# Altium project KeyBoard-RP2040.PrjPcb
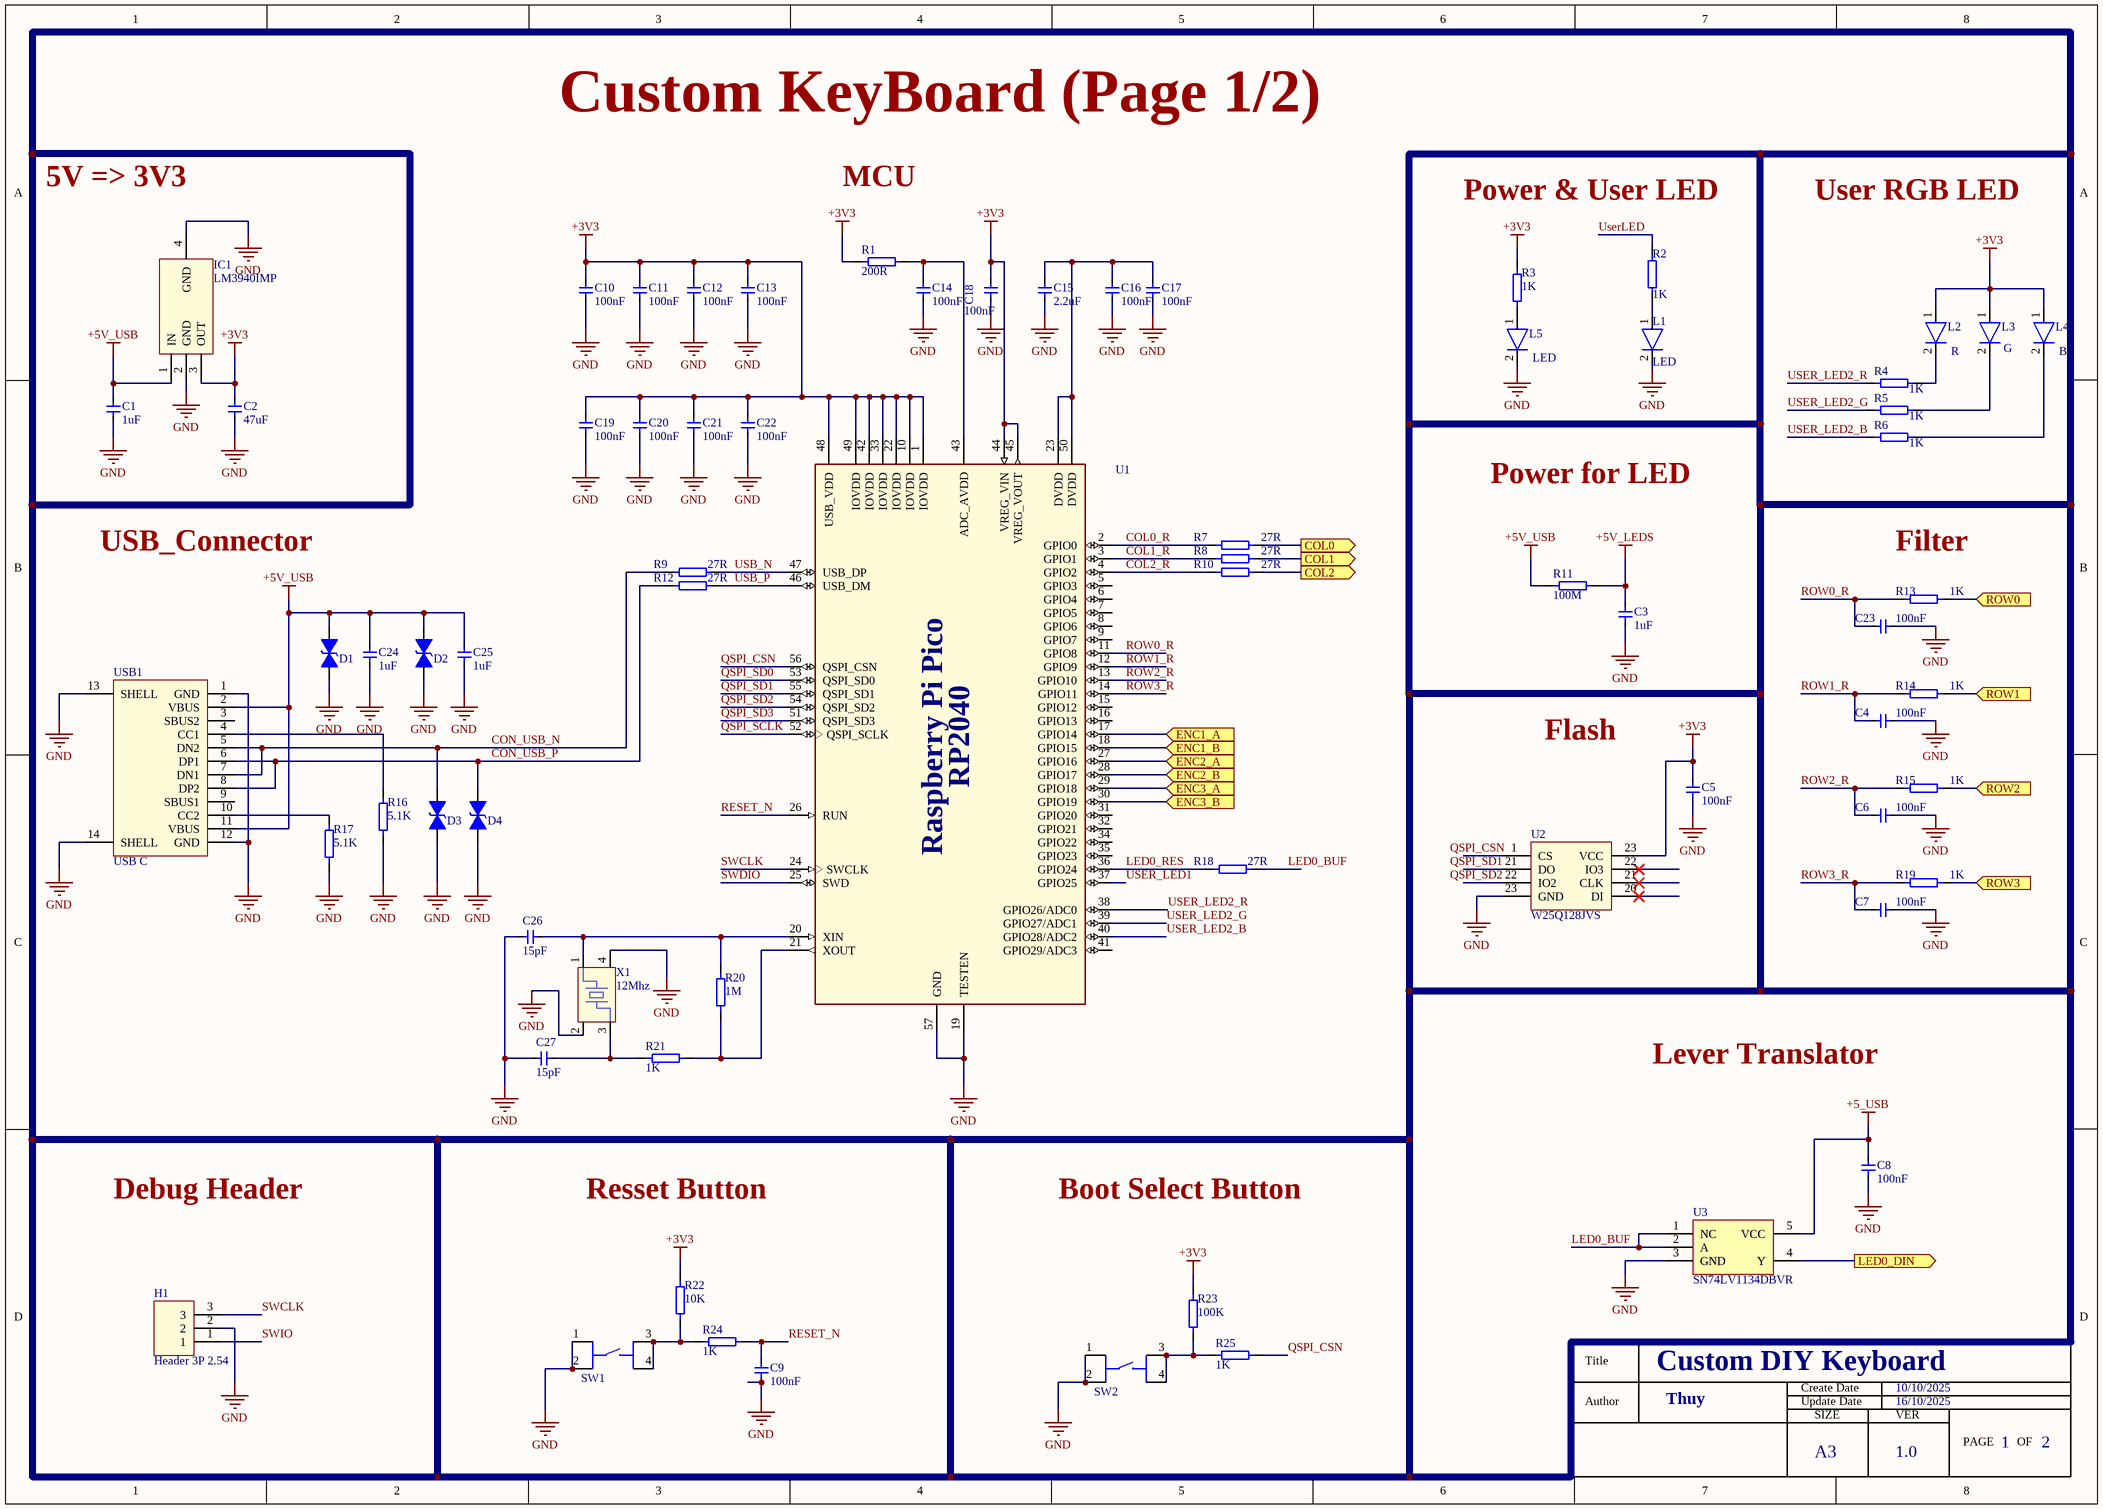
[diagram p0: KeyBoard-RP2040_P1.SchDoc]
2 sheets, 146 parts. Net scope: flat (ports and power ports of the same name join across sheets).
Board file: KeyBoard-RP2040.PcbDoc
Sheets:
  KeyBoard-RP2040_P1.SchDoc
  KeyBoard-RP2040_P2.SchDoc

## Sheet KeyBoard-RP2040_P1.SchDoc
size A3; SheetNumber: 1; SheetTotal: 2

### Parts
C1  1uF  [C 0.79 0.54]
C2  47uF  [C 1.485 1.728]
C3  1uF  [C 0.79 0.54]
C4  100nF  [C 0.79 0.54]
C5  100nF  [C 0.79 0.54]
C6  100nF  [C 0.79 0.54]
C7  100nF  [C 0.79 0.54]
C8  100nF  [C 0.79 0.54]
C9  100nF  [C 0.79 0.54]
C10  100nF  [C 0.79 0.54]
C11  100nF  [C 0.79 0.54]
C12  100nF  [C 0.79 0.54]
C13  100nF  [C 0.79 0.54]
C14  100nF  [C 0.79 0.54]
C15  2.2uF  [C 0.79 0.54]
C16  100nF  [C 0.79 0.54]
C17  100nF  [C 0.79 0.54]
C18  100nF  [C 0.79 0.54]
C19  100nF  [C 0.79 0.54]
C20  100nF  [C 0.79 0.54]
C21  100nF  [C 0.79 0.54]
C22  100nF  [C 0.79 0.54]
C23  100nF  [C 0.79 0.54]
C24  1uF  [C 0.79 0.54]
C25  1uF  [C 0.79 0.54]
C26  15pF  [C 0.79 0.54]
C27  15pF  [C 0.79 0.54]
D1  ESD GG0402052R542P  [D 0.6]  (value not drawn)
D2  ESD GG0402052R542P  [D 0.6]  (value not drawn)
D3  ESD GG0402052R542P  [D 0.6]  (value not drawn)
D4  ESD GG0402052R542P  [D 0.6]  (value not drawn)
H1  Header 3P 2.54  [Header 1x3]
IC1  LM3940IMP  [LM39]
L1  LED  [LED]
L2  R  [LED]
L3  G  [LED]
L4  B  [LED]
L5  LED  [LED]
R1  200R  [SMD 0.566 0.54]
R2  1K  [SMD 0.566 0.54]
R3  1K  [SMD 0.566 0.54]
R4  1K  [SMD 0.566 0.54]
R5  1K  [SMD 0.566 0.54]
R6  1K  [SMD 0.566 0.54]
R7  27R  [SMD 0.566 0.54]
R8  27R  [SMD 0.566 0.54]
R9  27R  [SMD 0.566 0.54]
R10  27R  [SMD 0.566 0.54]
R11  100M  [SMD 0.566 0.54]
R12  27R  [SMD 0.566 0.54]
R13  1K  [SMD 0.566 0.54]
R14  1K  [SMD 0.566 0.54]
R15  1K  [SMD 0.566 0.54]
R16  5.1K  [SMD 0.566 0.54]
R17  5.1K  [SMD 0.566 0.54]
R18  27R  [SMD 0.566 0.54]
R19  1K  [SMD 0.566 0.54]
R20  1M  [SMD 0.566 0.54]
R21  1K  [SMD 0.566 0.54]
R22  10K  [SMD 0.566 0.54]
R23  100K  [SMD 0.566 0.54]
R24  1K  [SMD 0.566 0.54]
R25  1K  [SMD 0.566 0.54]
SW1  BUTTON  [Button]  (value not drawn)
SW2  BUTTON  [Button]  (value not drawn)
U1  RP2040  [RP2040]  (value not drawn)
U2  W25Q128JVS  [W25Q128JVS]
U3  SN74LV1134DBVR
USB1  USB C  [USB-C]
X1  12Mhz  [ABM8]

### Ports
COL0 (out), COL1 (out), COL2 (out), ENC1_A (in), ENC1_B (in), ENC2_A (in), ENC2_B (in), ENC3_A (in), ENC3_B (in), LED0_DIN (out), ROW0 (in), ROW1 (in), ROW2 (in), ROW3 (in)

### Nets
+3V3: C2.2 C5.2 C10.2 C11.2 C12.2 C13.2 C18.2 C19.2 C20.2 C21.2 C22.2 IC1.3(OUT) L2.1 L3.1 L4.1 R1.1 R3.2 R22.2 R23.2 U1.1(IOVDD) U1.10(IOVDD) U1.22(IOVDD) U1.33(IOVDD) U1.42(IOVDD) U1.44(VREG_VIN) U1.45(VREG_VOUT) U1.48(USB_VDD) U1.49(IOVDD) U2.23(VCC)
+5_USB: C8.2 U3.5(VCC)
+5V_LEDS: C3.2 R11.2
+5V_USB: C1.2 C24.2 C25.2 D1.2 D2.2 IC1.1(IN) R11.1 USB1.2(VBUS) USB1.11(VBUS)
GND: C1.1 C2.1 C3.1 C4.1 C5.1 C6.1 C7.1 C8.1 C9.1 C10.1 C11.1 C12.1 C13.1 C14.1 C15.1 C16.1 C17.1 C18.1 C19.1 C20.1 C21.1 C22.1 C23.1 C24.1 C25.1 C26.1 C27.1 D1.1 D2.1 D3.1 D4.1 H1.2 IC1.2(GND) IC1.4(GND) L1.2 L5.2 R16.1 R17.1 SW1.1 SW1.2 SW2.1 SW2.2 U1.19(TESTEN) U1.57(GND) U2.23(GND) U3.3(GND) USB1.1(GND) USB1.12(GND) USB1.13(SHELL) USB1.14(SHELL) X1.2(GND) X1.4(GND)
COL0: R7.2 ; port COL0
COL0_R: R7.1 U1.2(GPIO0)
COL1: R8.2 ; port COL1
COL1_R: R8.1 U1.3(GPIO1)
COL2: R10.2 ; port COL2
COL2_R: R10.1 U1.4(GPIO2)
CON_USB_N: D3.2 R9.1 USB1.5(DN2) USB1.7(DN1)
CON_USB_P: D4.2 R12.1 USB1.6(DP1) USB1.8(DP2)
LED0_BUF: R18.2 U3.1(NC) U3.2(A)
LED0_RES: R18.1 U1.36(GPIO24)
QSPI_CSN: R25.2 U1.56(QSPI_CSN)
QSPI_SCLK: U1.52(QSPI_SCLK)
QSPI_SD0: U1.53(QSPI_SD0)
QSPI_SD1: U1.55(QSPI_SD1)
QSPI_SD2: U1.54(QSPI_SD2)
QSPI_SD3: U1.51(QSPI_SD3)
RESET_N: C9.2 R24.2 U1.26(RUN)
ROW0_R: C23.2 R13.1 U1.11(GPIO8)
ROW1_R: C4.2 R14.1 U1.12(GPIO9)
ROW2_R: C6.2 R15.1 U1.13(GPIO10)
ROW3_R: C7.2 R19.1 U1.14(GPIO11)
SWCLK: H1.3 U1.24(SWCLK)
SWDIO: U1.25(SWD)
SWIO: H1.1
USB_N: R9.2 U1.47(USB_DP)
USB_P: R12.2 U1.46(USB_DM)
USER_LED1: U1.37(GPIO25)
USER_LED2_B: R6.2 U1.40(GPIO28/ADC2)
USER_LED2_G: R5.2 U1.39(GPIO27/ADC1)
USER_LED2_R: R4.2 U1.38(GPIO26/ADC0)
UserLED: R2.2
NetC14_2: C14.2 R1.2 U1.43(ADC_AVDD)
NetC15_2: C15.2 C16.2 C17.2 U1.23(DVDD) U1.50(DVDD)
NetC26_2: C26.2 R20.2 U1.20(XIN) X1.1
NetC27_2: C27.2 R21.1 X1.3
NetC30_2: U1.18(GPIO15) ; port ENC1_B
NetC31_2: U1.17(GPIO14) ; port ENC1_A
NetC32_2: U1.30(GPIO19) ; port ENC3_B
NetC33_2: U1.29(GPIO18) ; port ENC3_A
NetC35_2: U1.28(GPIO17) ; port ENC2_B
NetC36_2: U1.27(GPIO16) ; port ENC2_A
NetD5_1: R13.2 ; port ROW0
NetD8_1: R14.2 ; port ROW1
NetD11_1: R15.2 ; port ROW2
NetD14_1: R19.2 ; port ROW3
NetL1_1: L1.1 R2.1
NetL2_2: L2.2 R4.1
NetL3_2: L3.2 R5.1
NetL4_2: L4.2 R6.1
NetL5_1: L5.1 R3.1
NetLED1_4: U3.4(Y) ; port LED0_DIN
NetR16_2: R16.2 USB1.4(CC1)
NetR17_2: R17.2 USB1.10(CC2)
NetR20_1: R20.1 R21.2 U1.21(XOUT)
NetR22_1: R22.1 R24.1 SW1.3 SW1.4
NetR23_1: R23.1 R25.1 SW2.3 SW2.4

Not connected (* = marked no-connect by the designer): U1 5(GPIO3) 6(GPIO4) 7(GPIO5) 8(GPIO6) 9(GPIO7) 15(GPIO12) 16(GPIO13) 31(GPIO20) 32(GPIO21) 34(GPIO22) 35(GPIO23) 41(GPIO29/ADC3); U2 1(CS) 20(DI)* 21(DO) 22(IO2); USB1 3(SBUS2) 9(SBUS1)

### Notes on the sheet
- Custom KeyBoard (Page 1/2)
- 5V => 3V3
- MCU
- Power & User LED
- User RGB LED
- Power for LED
- USB_Connector
- (near R13) Filter
- Flash
- Lever Translator
- Debug Header
- Resset Button
- Boot Select Button
- Custom DIY Keyboard
- 10/10/2025
- Thuy
- 1.0
- 16/10/2025
- 1
- 2
- Labels drawn without touching a wire or pin: QSPI_CSN, QSPI_SD1, QSPI_SD2
- Title
- Create Date
- Author
- Update Date
- SIZE
- A3
- VER
- PAGE
- OF
- (in symbol Rasberry Pi Pico-RP2040) Raspberry Pi Pico

### Library data of the parts
C1 C3 C24 C25 = CAP 1uF: SMD 0402
C2 = CAP 47uF: SMD
C4-C14 C16-C23 = CAP 100nF: SMD
C15 = CAP 2.2uF: SMD
C26 C27 = CAP 15pF: SMD
D1-D4 = ESD GG0402052R542P: SMD
H1 = Header 1x3: THT
IC1 = LM3940IMP: SOP | 5v->3v3 |
L1-L5 = LED2
R1 = RES 200R: SMD
R2-R6 R13-R15 R19 R21 R24 R25 = RES 1K: SMD
R7-R10 R12 R18 = Res 27R: SMD
R11 = RES 100M: SMD
R16 R17 = RES 5.1K: SMD
R20 = RES 1M: SMD
R22 = RES 10K: SMD
R23 = RES 100K: SMD
SW1 SW2 = BUTTON: SMD
U1 = Rasberry Pi Pico-RP2040: RP2040 chip for Raspberry Pi Pico - ARM® Cortex®-M0+ MCU 32-Bit
U2 = W25Q128JVS: SMD
X1 = Crystal ABM8-272-T3: SMD

## Sheet KeyBoard-RP2040_P2.SchDoc
size A3; SheetNumber: 2; SheetTotal: 2
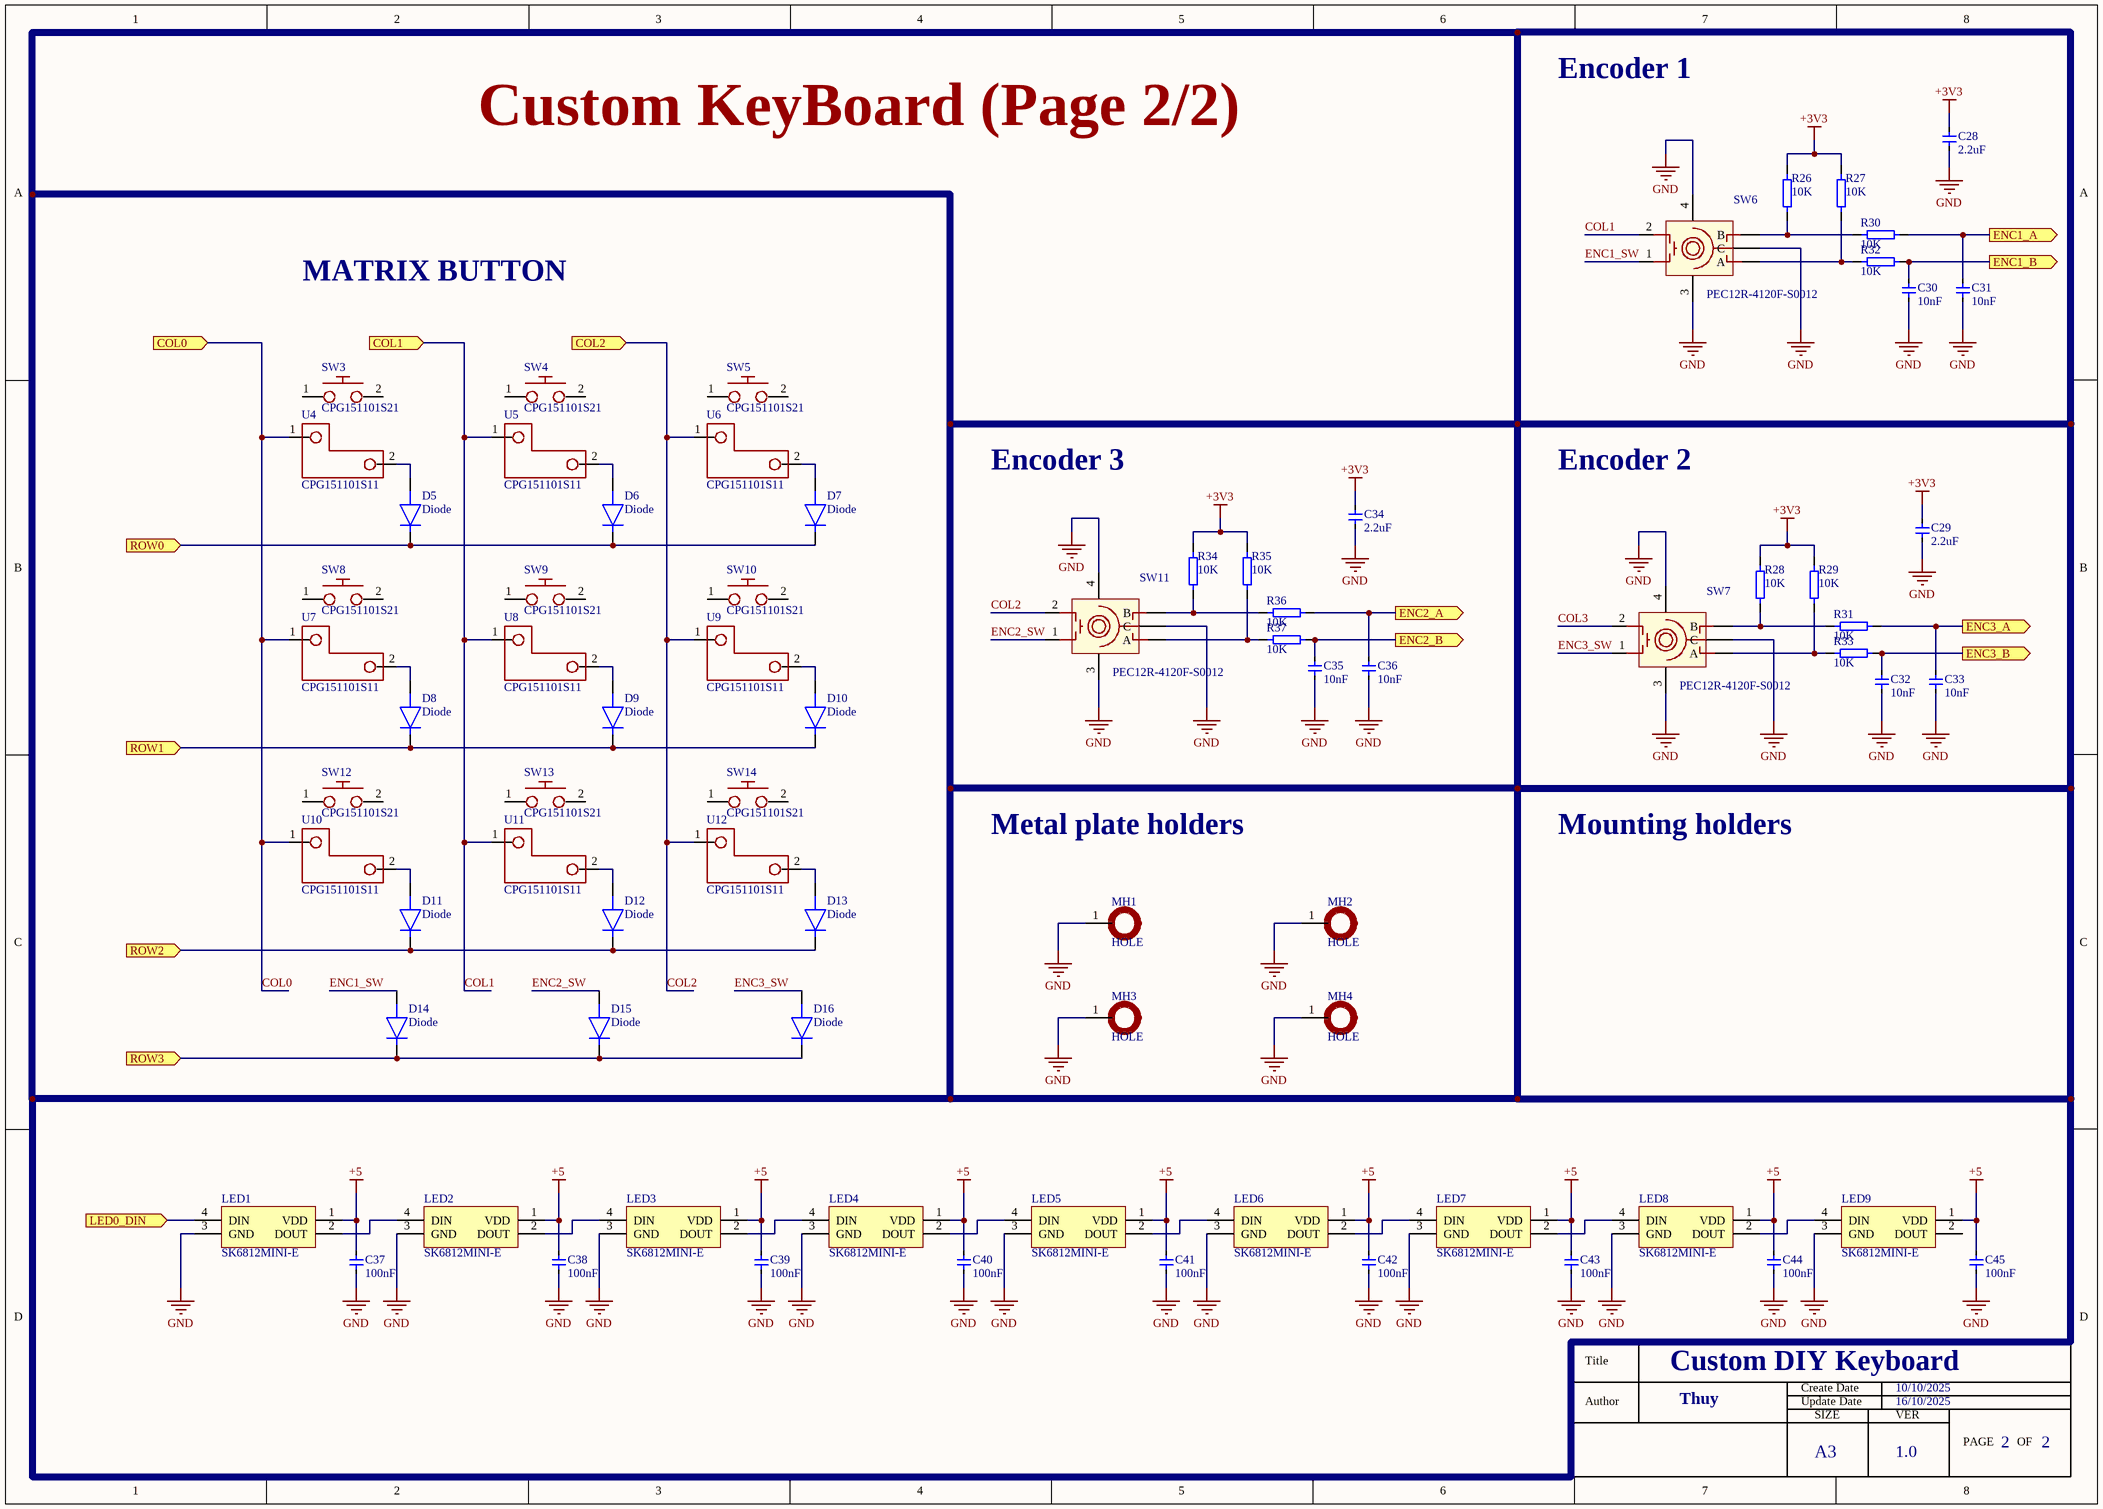
[diagram p1: KeyBoard-RP2040_P2.SchDoc]

### Parts
C28  2.2uF  [C 0.79 0.54]
C29  2.2uF  [C 0.79 0.54]
C30  10nF  [SMD 0.79 0.54]
C31  10nF  [SMD 0.79 0.54]
C32  10nF  [SMD 0.79 0.54]
C33  10nF  [SMD 0.79 0.54]
C34  2.2uF  [C 0.79 0.54]
C35  10nF  [SMD 0.79 0.54]
C36  10nF  [SMD 0.79 0.54]
C37  100nF  [C 0.79 0.54]
C38  100nF  [C 0.79 0.54]
C39  100nF  [C 0.79 0.54]
C40  100nF  [C 0.79 0.54]
C41  100nF  [C 0.79 0.54]
C42  100nF  [C 0.79 0.54]
C43  100nF  [C 0.79 0.54]
C44  100nF  [C 0.79 0.54]
C45  100nF  [C 0.79 0.54]
D5  Diode  [Diode]
D6  Diode  [Diode]
D7  Diode  [Diode]
D8  Diode  [Diode]
D9  Diode  [Diode]
D10  Diode  [Diode]
D11  Diode  [Diode]
D12  Diode  [Diode]
D13  Diode  [Diode]
D14  Diode  [Diode]
D15  Diode  [Diode]
D16  Diode  [Diode]
LED1  SK6812MINI-E  [LED-SK6812MINI-E]
LED2  SK6812MINI-E  [LED-SK6812MINI-E]
LED3  SK6812MINI-E  [LED-SK6812MINI-E]
LED4  SK6812MINI-E  [LED-SK6812MINI-E]
LED5  SK6812MINI-E  [LED-SK6812MINI-E]
LED6  SK6812MINI-E  [LED-SK6812MINI-E]
LED7  SK6812MINI-E  [LED-SK6812MINI-E]
LED8  SK6812MINI-E  [LED-SK6812MINI-E]
LED9  SK6812MINI-E  [LED-SK6812MINI-E]
MH1  HOLE  [Hole]
MH2  HOLE  [Hole]
MH3  HOLE  [Hole]
MH4  HOLE  [Hole]
R26  10K  [SMD 0.566 0.54]
R27  10K  [SMD 0.566 0.54]
R28  10K  [SMD 0.566 0.54]
R29  10K  [SMD 0.566 0.54]
R30  10K  [SMD 0.566 0.54]
R31  10K  [SMD 0.566 0.54]
R32  10K  [SMD 0.566 0.54]
R33  10K  [SMD 0.566 0.54]
R34  10K  [SMD 0.566 0.54]
R35  10K  [SMD 0.566 0.54]
R36  10K  [SMD 0.566 0.54]
R37  10K  [SMD 0.566 0.54]
SW3  CPG151101S21  [CPG151101S21]
SW4  CPG151101S21  [CPG151101S21]
SW5  CPG151101S21  [CPG151101S21]
SW6  PEC12R-4120F-S0012  [SW-encoder]
SW7  PEC12R-4120F-S0012  [SW-encoder]
SW8  CPG151101S21  [CPG151101S21]
SW9  CPG151101S21  [CPG151101S21]
SW10  CPG151101S21  [CPG151101S21]
SW11  PEC12R-4120F-S0012  [SW-encoder]
SW12  CPG151101S21  [CPG151101S21]
SW13  CPG151101S21  [CPG151101S21]
SW14  CPG151101S21  [CPG151101S21]
U4  CPG151101S11  [CPG151101S11]
U5  CPG151101S11  [CPG151101S11]
U6  CPG151101S11  [CPG151101S11]
U7  CPG151101S11  [CPG151101S11]
U8  CPG151101S11  [CPG151101S11]
U9  CPG151101S11  [CPG151101S11]
U10  CPG151101S11  [CPG151101S11]
U11  CPG151101S11  [CPG151101S11]
U12  CPG151101S11  [CPG151101S11]

### Ports
COL0 (in), COL1 (in), COL2 (in), ENC1_A (out), ENC1_B (out), ENC2_A (out), ENC2_B (out), ENC3_A (out), ENC3_B (out), LED0_DIN (in), ROW0 (in), ROW1 (in), ROW2 (in), ROW3 (in)

### Nets
+3V3: C28.2 C29.2 C34.2 R26.2 R27.2 R28.2 R29.2 R34.2 R35.2
+5: C37.2 C38.2 C39.2 C40.2 C41.2 C42.2 C43.2 C44.2 C45.2 LED1.1(VDD) LED2.1(VDD) LED3.1(VDD) LED4.1(VDD) LED5.1(VDD) LED6.1(VDD) LED7.1(VDD) LED8.1(VDD) LED9.1(VDD)
GND: C28.1 C29.1 C30.1 C31.1 C32.1 C33.1 C34.1 C35.1 C36.1 C37.1 C38.1 C39.1 C40.1 C41.1 C42.1 C43.1 C44.1 C45.1 LED1.3(GND) LED2.3(GND) LED3.3(GND) LED4.3(GND) LED5.3(GND) LED6.3(GND) LED7.3(GND) LED8.3(GND) LED9.3(GND) MH1.1 MH2.1 MH3.1 MH4.1 SW6.3 SW6.4 SW6.6(C) SW7.3 SW7.4 SW7.6(C) SW11.3 SW11.4 SW11.6(C)
COL0: U4.1 U7.1 U10.1 ; port COL0
COL1: SW6.2 U5.1 U8.1 U11.1 ; port COL1
COL2: SW11.2 U6.1 U9.1 U12.1 ; port COL2
COL3: SW7.2
ENC1_SW: D14.2 SW6.1
ENC2_SW: D15.2 SW11.1
ENC3_SW: D16.2 SW7.1
NetC30_2: C30.2 R32.1 ; port ENC1_B
NetC31_2: C31.2 R30.1 ; port ENC1_A
NetC32_2: C32.2 R33.1 ; port ENC3_B
NetC33_2: C33.2 R31.1 ; port ENC3_A
NetC35_2: C35.2 R37.1 ; port ENC2_B
NetC36_2: C36.2 R36.1 ; port ENC2_A
NetD5_1: D5.1 D6.1 D7.1 ; port ROW0
NetD5_2: D5.2 U4.2
NetD6_2: D6.2 U5.2
NetD7_2: D7.2 U6.2
NetD8_1: D8.1 D9.1 D10.1 ; port ROW1
NetD8_2: D8.2 U7.2
NetD9_2: D9.2 U8.2
NetD10_2: D10.2 U9.2
NetD11_1: D11.1 D12.1 D13.1 ; port ROW2
NetD11_2: D11.2 U10.2
NetD12_2: D12.2 U11.2
NetD13_2: D13.2 U12.2
NetD14_1: D14.1 D15.1 D16.1 ; port ROW3
NetLED1_2: LED1.2(DOUT) LED2.4(DIN)
NetLED1_4: LED1.4(DIN) ; port LED0_DIN
NetLED2_2: LED2.2(DOUT) LED3.4(DIN)
NetLED3_2: LED3.2(DOUT) LED4.4(DIN)
NetLED4_2: LED4.2(DOUT) LED5.4(DIN)
NetLED5_2: LED5.2(DOUT) LED6.4(DIN)
NetLED6_2: LED6.2(DOUT) LED7.4(DIN)
NetLED7_2: LED7.2(DOUT) LED8.4(DIN)
NetLED8_2: LED8.2(DOUT) LED9.4(DIN)
NetR26_1: R26.1 R30.2 SW6.7(B)
NetR27_1: R27.1 R32.2 SW6.5(A)
NetR28_1: R28.1 R31.2 SW7.7(B)
NetR29_1: R29.1 R33.2 SW7.5(A)
NetR34_1: R34.1 R36.2 SW11.7(B)
NetR35_1: R35.1 R37.2 SW11.5(A)

Not connected (* = marked no-connect by the designer): LED9 2(DOUT); SW3 1 2; SW4 1 2; SW5 1 2; SW8 1 2; SW9 1 2; SW10 1 2; SW12 1 2; SW13 1 2; SW14 1 2

### Notes on the sheet
- Encoder 1
- Custom KeyBoard (Page 2/2)
- MATRIX BUTTON
- Encoder 3
- Encoder 2
- Metal plate holders
- Mounting holders
- Custom DIY Keyboard
- 10/10/2025
- Thuy
- 1.0
- 16/10/2025
- 2
- Title
- Create Date
- Author
- Update Date
- SIZE
- A3
- VER
- PAGE
- OF

### Library data of the parts
C28 C29 C34 = CAP 2.2uF: SMD
C30-C33 C35 C36 = CAP 10nF: SMD
C37-C45 = CAP 100nF: SMD
D5-D16 = Diode: SMD
LED1-LED9 = LED-SK6812MINI-E: RGB 3.7V~5.5V 0.6mA
R26-R37 = RES 10K: SMD
SW3-SW5 SW8-SW10 SW12-SW14 = SW-CPG151101S21
SW6 SW7 SW11 = Encoder-PEC12R
U4-U12 = SW-CPG151101S11

## Nets that join several sheets
+3V3: KeyBoard-RP2040_P1 (29 pins), KeyBoard-RP2040_P2 (9 pins)
GND: KeyBoard-RP2040_P1 (52 pins), KeyBoard-RP2040_P2 (40 pins)
COL0: KeyBoard-RP2040_P1 (R7.2), KeyBoard-RP2040_P2 (U4.1 U7.1 U10.1)
COL1: KeyBoard-RP2040_P1 (R8.2), KeyBoard-RP2040_P2 (SW6.2 U5.1 U8.1 U11.1)
COL2: KeyBoard-RP2040_P1 (R10.2), KeyBoard-RP2040_P2 (SW11.2 U6.1 U9.1 U12.1)
NetC30_2: KeyBoard-RP2040_P1 (U1.18), KeyBoard-RP2040_P2 (C30.2 R32.1)
NetC31_2: KeyBoard-RP2040_P1 (U1.17), KeyBoard-RP2040_P2 (C31.2 R30.1)
NetC32_2: KeyBoard-RP2040_P1 (U1.30), KeyBoard-RP2040_P2 (C32.2 R33.1)
NetC33_2: KeyBoard-RP2040_P1 (U1.29), KeyBoard-RP2040_P2 (C33.2 R31.1)
NetC35_2: KeyBoard-RP2040_P1 (U1.28), KeyBoard-RP2040_P2 (C35.2 R37.1)
NetC36_2: KeyBoard-RP2040_P1 (U1.27), KeyBoard-RP2040_P2 (C36.2 R36.1)
NetD5_1: KeyBoard-RP2040_P1 (R13.2), KeyBoard-RP2040_P2 (D5.1 D6.1 D7.1)
NetD8_1: KeyBoard-RP2040_P1 (R14.2), KeyBoard-RP2040_P2 (D8.1 D9.1 D10.1)
NetD11_1: KeyBoard-RP2040_P1 (R15.2), KeyBoard-RP2040_P2 (D11.1 D12.1 D13.1)
NetD14_1: KeyBoard-RP2040_P1 (R19.2), KeyBoard-RP2040_P2 (D14.1 D15.1 D16.1)
NetLED1_4: KeyBoard-RP2040_P1 (U3.4), KeyBoard-RP2040_P2 (LED1.4)